# EAGLE design usb c (EAGLE 9.6.2)
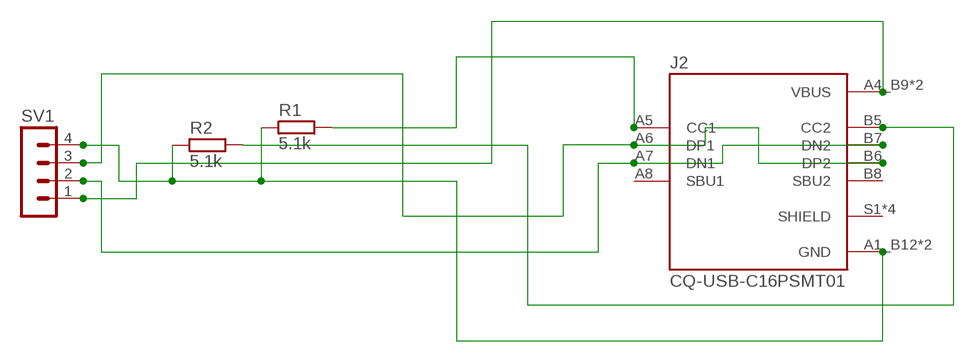
[diagram p0: schematic, sheet 1]

## Parts
J2  CQ-USB-C16PSMT01  [SHENZHEN-CHUANGQIN-TECHNOLOGY_CQ-USB-C16PSMT01]
R1  5.1k  R_0603  [R0603]
R2  5.1k  R_0603  [R0603]
SV1  MA04-1  [MA04-1]

## Nets
CC1: J2.A5(CC1) R1.2
CC2: J2.B5(CC2) R2.2
DN1: J2.A7(DN1) J2.B7(DN2) SV1.2
DP1: J2.A6(DP1) J2.B6(DP2) SV1.3
GND: J2.A1_B12(GND) J2.B1_A12(GND) R1.1 R2.1 SV1.4
VBUS: J2.A4_B9(VBUS) J2.B4_A9(VBUS) SV1.1
Unconnected: J2.A8(SBU1) J2.B8(SBU2) J2.S1(SHIELD) J2.S2(SHIELD) J2.S3(SHIELD) J2.S4(SHIELD)

## Library data of the parts
J2 = CQ-USB-C16PSMT01:CQ-USB-C16PSMT01: C Type USB Type-C Female Plug 16 Pin Connector Power Charger Jack Port Check availability <https://pricing.snapeda.com/parts/CQ-USB-C16PSMT01/Shenzen%20Chuangqin%20Technology/view-part?ref=eda>; AVAILABILITY: Not in stock; DESCRIPTION: C Type USB Type-C Female Plug 16 Pin Connector Power Charger Jack Port; MF: Shenzen Chuangqin Technology; MP: CQ-USB-C16PSMT01; PACKAGE: Package; PRICE: None
R1 R2 = rc-master-smd:R_: RESISTOR
SV1 = con-lstb:MA04-1: PIN HEADER; OC_FARNELL: unknown; OC_NEWARK: unknown

## Module USB
Ports: 

### Library data of the parts

## Net classes
0 default: clearance 0.205 mm

## Board
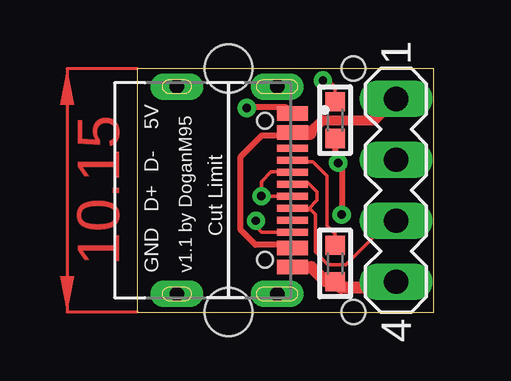
[diagram p1: board, top side]
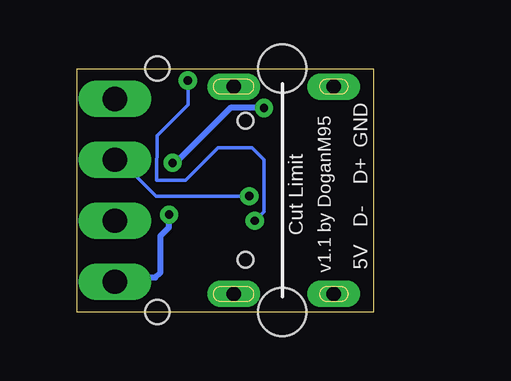
[diagram p2: board, bottom side, seen from below]

Size 12.37 x 10.15 mm. Coordinates in mm from the lower left corner, seen from the top.
Outline: 0,0 12.37,0 12.37,10.15 0,10.15 0,0
Copper layers (1*16): Top 0.035mm / dielectric 1.5mm / Bottom 0.035mm
Design rules "default *": minimum track width 6mil, minimum drill 0.35mm, track to track 6mil, track to pad 6mil, pad to pad 6mil, via to via 6mil, smd to smd 6mil, copper to edge 40mil, drill to drill 6mil, minimum pad ring 10mil, minimum via ring 8mil, stop-mask expansion 4mil, vias tented up to drill 20mil, thermal gap 10mil
Holes 2 mm at 3.81,10.16 3.81,0
Holes 1 mm at 9.02,10.16 9.02,0

### Footprints (pad centres in the part's own frame; a part is rotated, then mirrored left to right if it is on the bottom)
SHENZHEN-CHUANGQIN-TECHNOLOGY_CQ-USB-C16PSMT01 = smd 0.6 x 1.3: A1_B12 -3.2,0; A4_B9 -2.4,0; B1_A12 3.2,0; B4_A9 2.4,0 | smd 0.3 x 1.3: A5 -1.25,0; A6 -0.25,0; A7 0.25,0; A8 1.25,0; B5 1.75,0; B6 0.75,0; B7 -0.75,0; B8 -1.75,0 | drill 0.6 pad 1.05 long: S1 -4.32,-0.64; S2 4.32,-0.64 | drill 0.6 pad 0.8 long: S3 -4.32,-4.82; S4 4.32,-4.82 | hole 0.65: -2.89,-1.14; 2.89,-1.14
R0603 = smd 0.8 x 0.8: 1 -0.762,0; 2 0.762,0
MA04-1 = drill 1.016 long: 1 -3.81,0; 2 -1.27,0; 3 1.27,0; 4 3.81,0

### Placement (x,y rotation side)
J2  6.48,5.08 270 top
R1  8.26,2.03 90 top
R2  8.26,8 90 top
SV1  10.79,5.08 270 top

### Tracks (layer width: path | path; a pad name or v marks a point on that pad's centre or on a via)
CC1
  Top 0.152: R1.2 8.26,3.27 7.92,3.61 7.92,5.67 7.33,6.26 6.61,6.26 J2.A5
CC2  (via drill 0.35)
  Top 0.152: v7.75,9.65 8,9.65 8.26,9.4 R2.2 | J2.B5 6.41,3.4 6.13,3.4 6.2,3.33 J2.B5 | v4.95,3.81 4.95,3.56 5.18,3.33 J2.B5
  Bottom 0.152: v4.95,3.81 4.57,4.19 4.57,6.35 5.08,6.86 6.48,6.85 7.84,5.49 9.05,5.49 9.04,7.35 7.75,8.64 v7.75,9.65
DN1  (via drill 0.35)
  Top 0.152: J2.A7 6.43,4.83 v5.18,4.83 5.18,5.44 5.59,5.84 6.46,5.84 J2.B7
  Bottom 0.152: v5.18,4.83 9.07,4.83 10.58,6.35 SV1.2
DP1
  Top 0.152: J2.A6 6.61,5.37 7.15,5.37 7.5,5.01 7.5,4.65 7.15,4.3 6.61,4.3 J2.B6 6.55,4.26 7.24,4.26 7.43,4.07 7.43,2.51 7.97,1.97 8.71,1.97 10.45,3.71 SV1.3
GND  (via drill 0.35)
  Top 0.254: R2.1 8.26,6.35 v8.38,6.22 8.53,6.07 v8.53,4.07 | v4.57,8.51 4.6,8.53 6.22,8.53 J2.A1_B12
  Top 0.508: J2.B1_A12 7.26,1.88 7.87,1.27 R1.1 8.51,1.02 10.54,1.02 SV1.4
  Bottom 0.152: 8.54,3.53 8.53,3.53
  Bottom 0.254: 8.53,3.53 v8.53,4.07 | 8.54,3.53 8.89,3.17 8.89,1.65 9.1,1.44 10.62,1.44 SV1.4 | v8.38,6.22 8.26,6.22 5.94,8.53 4.6,8.53 v4.57,8.51
VBUS
  Top 0.254: J2.B4_A9 6.35,2.81 4.94,2.81 4.32,3.43 4.32,6.48 5.19,7.35 6.35,7.35 J2.A4_B9
  Top 0.406: SV1.1 9.91,8.01 7.72,8.01 7.19,7.48
  Top 0.61: 7.19,7.48 J2.A4_B9
(copper drawn outside any net)
  shapes: Top area x4

### Text on the board
tNames: 5V | D- | D+ | Cut Limit | GND | v1.1 by DoganM95
bNames: GND | Cut Limit | D+ | D- | 5V | v1.1 by DoganM95